# EasyEDA Pro project ESP32-S3-UNO_Easyeda_pro.epro

# Schematic Schematic1
Board Name: Board1; Create Date: 2025-07-17; Page Name: P1; Project Name: ESP32-S3-UNO; Schematic Name: Schematic1; Update Date: 2025-07-17; Company: EasyEDA.com; Page Size: A4; Version: V1.0
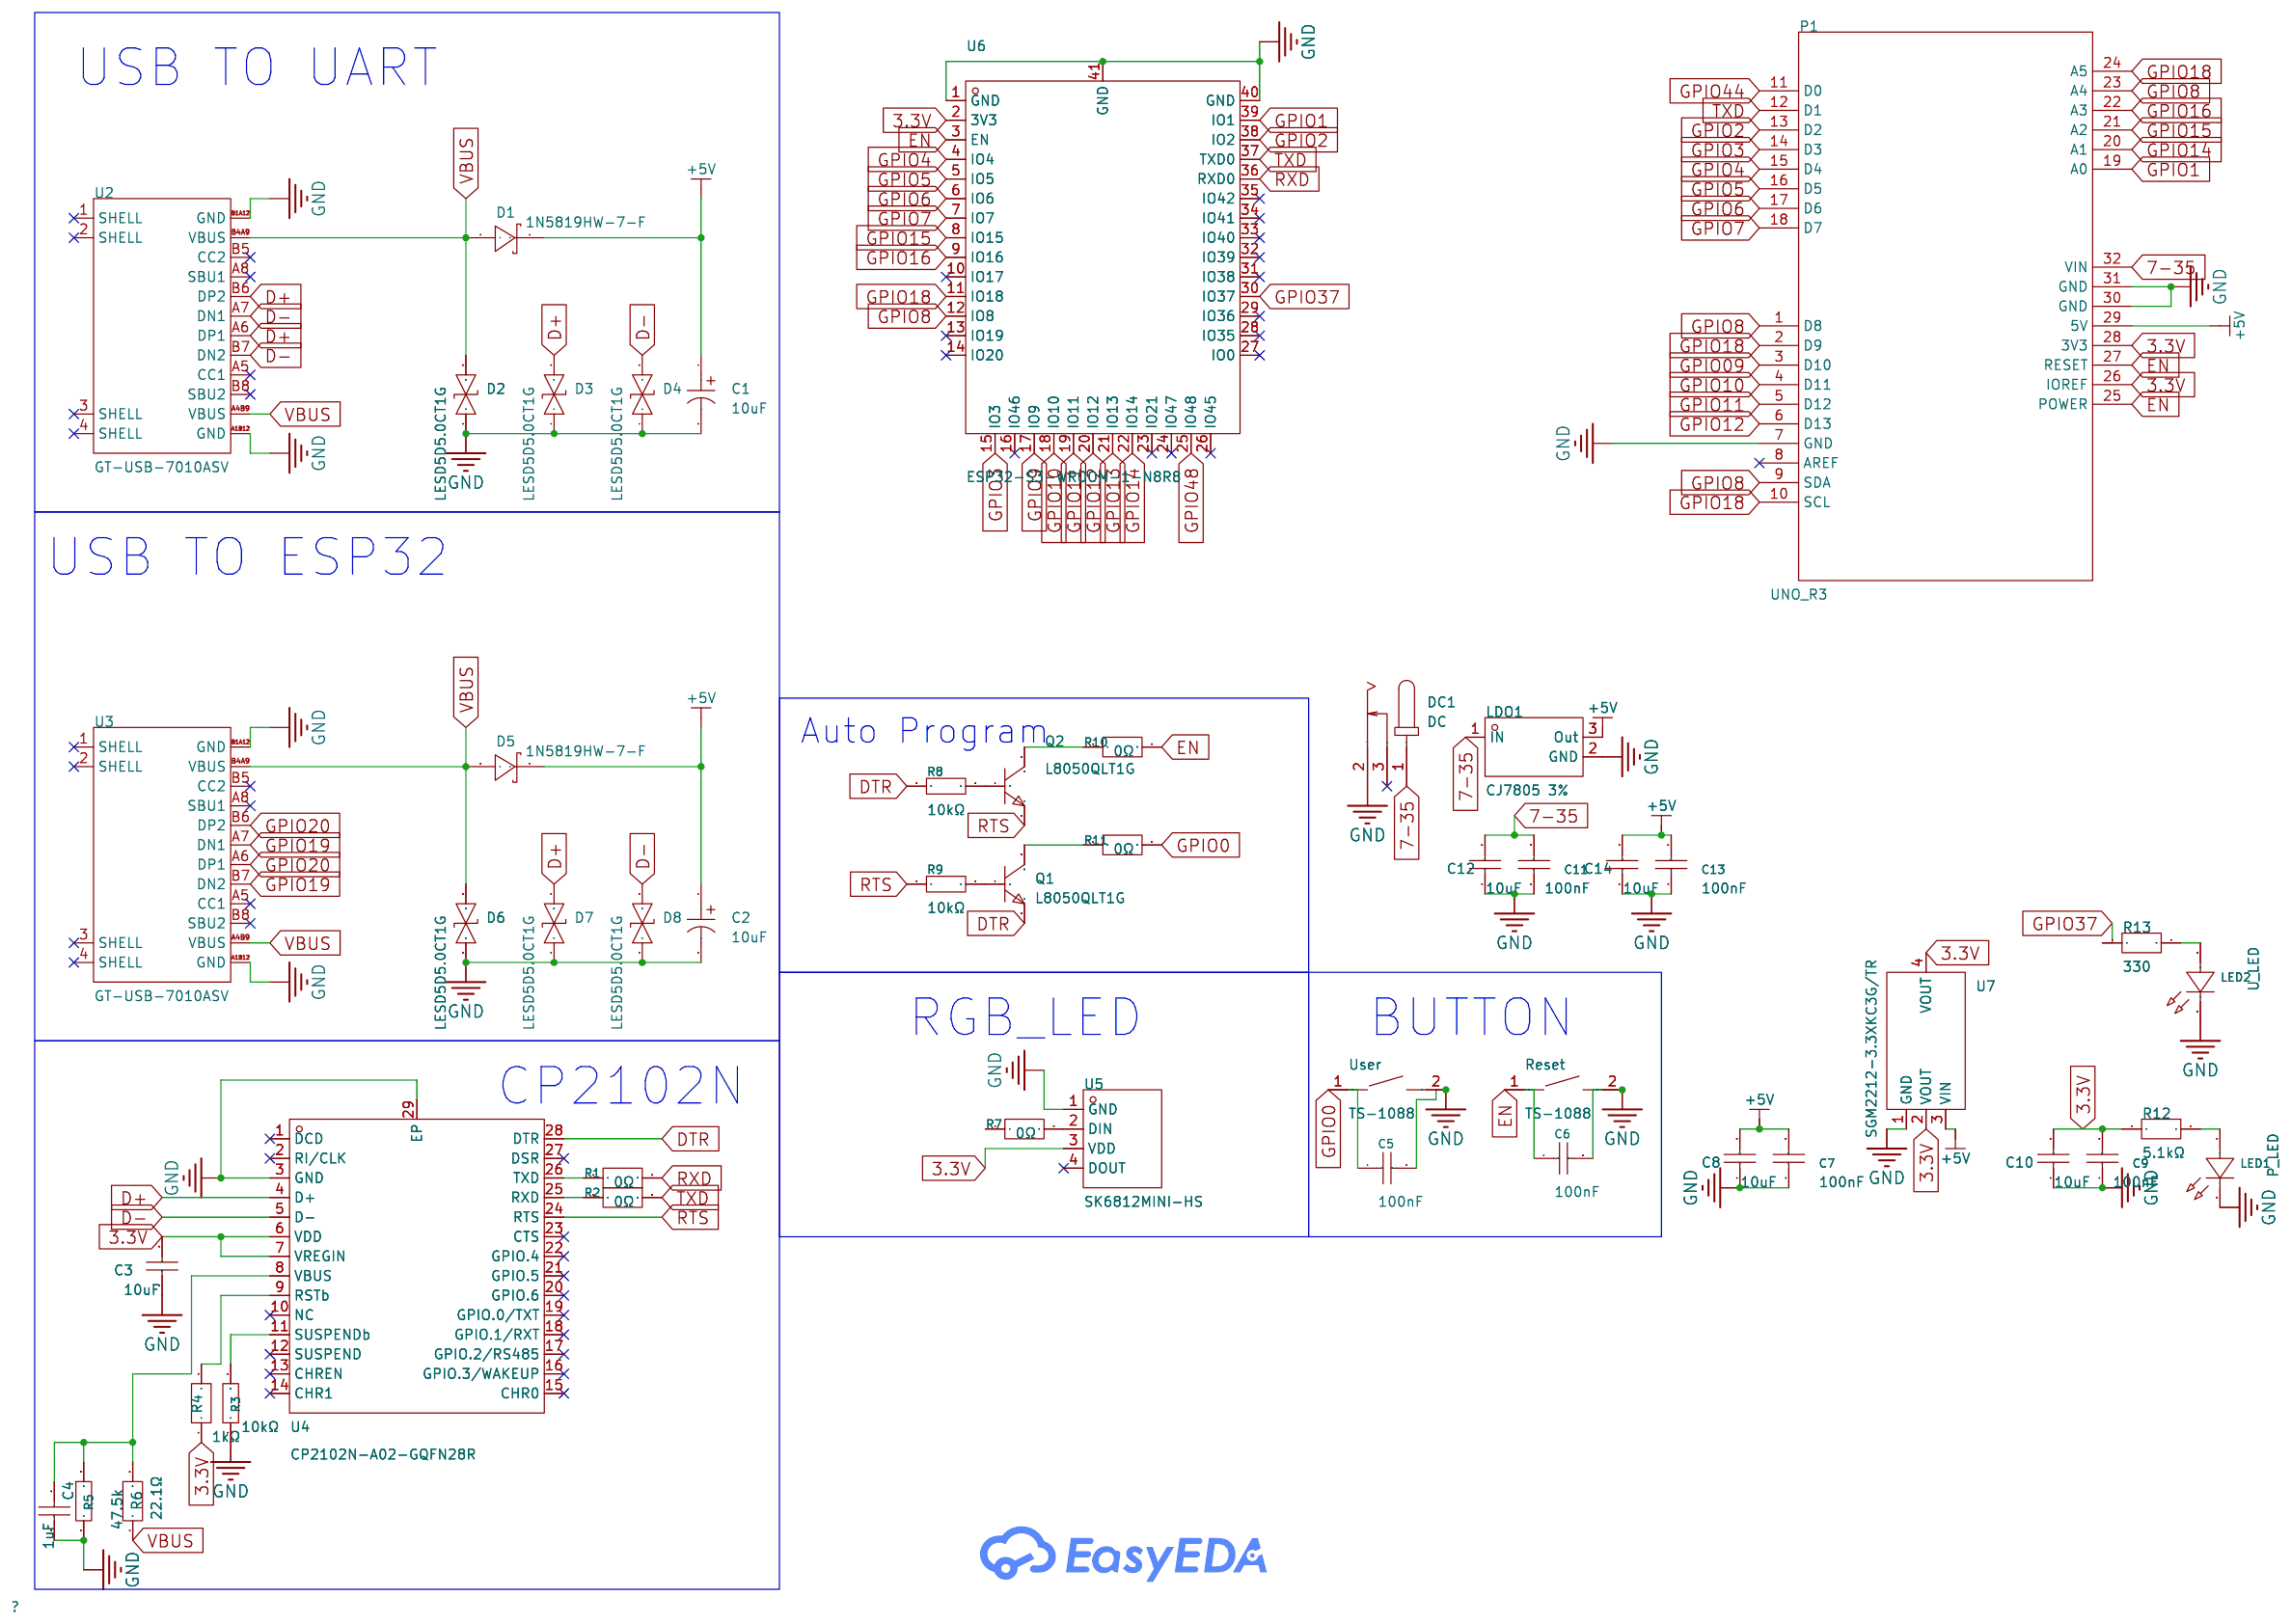
[diagram p0: schematic sheet]

## Parts
C1  10uF  [CAP-SMD_BD4.0-L4.3-W4.3-FD-LS5.3]
C2  10uF  [CAP-SMD_BD4.0-L4.3-W4.3-FD-LS5.3]
C3  10uF  [C1206]
C4  1uF  [C1206]
C5  100nF  [C1206]
C6  100nF  [C1206]
C7  100nF  [C1206]
C8  10uF  [C1206]
C9  100nF  [C1206]
C10  10uF  [C1206]
C11  100nF  [C1206]
C12  10uF  [C1206]
C13  100nF  [C1206]
C14  10uF  [C1206]
D1  1N5819HW-7-F  [SOD-123_L2.7-W1.6-LS3.7-RD]
D2  LESD5D5.0CT1G  [SOD-523_L1.2-W0.8-LS1.6-BI]
D3  LESD5D5.0CT1G  [SOD-523_L1.2-W0.8-LS1.6-BI]
D4  LESD5D5.0CT1G  [SOD-523_L1.2-W0.8-LS1.6-BI]
D5  1N5819HW-7-F  [SOD-123_L2.7-W1.6-LS3.7-RD]
D6  LESD5D5.0CT1G  [SOD-523_L1.2-W0.8-LS1.6-BI]
D7  LESD5D5.0CT1G  [SOD-523_L1.2-W0.8-LS1.6-BI]
D8  LESD5D5.0CT1G  [SOD-523_L1.2-W0.8-LS1.6-BI]
DC1  DC  [DC-IN-TH_DC005]
LDO1  CJ7805 3%  [TO-252-2_L6.6-W6.1-P4.58-LS10.1-BR-CW]
LED1  P_LED  [LED1206-R-RD_RED]
LED2  U_LED  [LED1206-R-RD_RED]
P1  UNO_R3  [UNO_R3]
Q1  L8050QLT1G  [SOT-23-3_L2.9-W1.3-P1.90-LS2.4-BR]
Q2  L8050QLT1G  [SOT-23-3_L2.9-W1.3-P1.90-LS2.4-BR]
R1  0Ω  [R1206]
R2  0Ω  [R1206]
R3  10kΩ  [R1206]
R4  1kΩ  [R1206]
R5  47.5k  [R1206]
R6  22.1Ω  [R1206]
R7  0Ω  [R1206]
R8  10kΩ  [R1206]
R9  10kΩ  [R1206]
R10  0Ω  [R1206]
R11  0Ω  [R1206]
R12  5.1kΩ  [R1206]
R13  330  [R1206]
Reset  TS-1088  [SW-SMD_L3.9-W3.0-P4.45]
U2  GT-USB-7010ASV  [USB-C-SMD_G-SWITCH_GT-USB-7010ASV]
U3  GT-USB-7010ASV  [USB-C-SMD_G-SWITCH_GT-USB-7010ASV]
U4  CP2102N-A02-GQFN28R  [QFN-28_L5.0-W5.0-P0.50-TL-EP3.3]
U5  SK6812MINI-HS  [LED-SMD_4P-L3.5-W3.5-BR_SK6812MINI-HS]
U6  ESP32-S3-WROOM-1-N8R8  [WIRELM-SMD_ESP32-S3-WROOM-1]
U7  SGM2212-3.3XKC3G/TR  [SOT-223-3_L6.5-W3.4-P2.30-LS7.0-BR]
User  TS-1088  [SW-SMD_L3.9-W3.0-P4.45]

## Library data of the parts
C1 C2 = EFVH025ADA100M0454: Capacitance:10uF Tolerance:±20% Tolerance:±20% Voltage Rating:25V Diameter:4mm Height - Seated (Max):5.4mm; LCSC Part Name: 10uF ±20% 25V; Supplier Part: C22387953; Manufacturer: FOLLON(富隆电子); Supplier Footprint: SMD,D4xL5.4mm; JLCPCB Part Class: Extended Part; Datasheet: https://atta.szlcsc.com/upload/public/pdf/source/20240424/E2403F09F3634268C234320018E14A29.pdf; Supplier: LCSC; Tolerance: ±20%; Voltage Rating: 25V; Diameter: 4mm; Height - Seated (Max): 5.4mm
C3 C8 C10 C12 C14 = CL31A106KBHNNNE: Capacitance: Tolerance:±10% Tolerance:±10% Voltage Rated: Temperature Coefficient:; LCSC Part Name: 10uF ±10% 50V; Supplier Part: C13585; Manufacturer: SAMSUNG(三星); Supplier Footprint: 1206; JLCPCB Part Class: Basic Part; Datasheet: https://atta.szlcsc.com/upload/public/pdf/source/20160218/1457707763339.pdf; Supplier: LCSC; Tolerance: ±10%
C4 = CL31B105KAHNNNE: Capacitance: Tolerance:±10% Tolerance:±10% Voltage Rated: Temperature Coefficient:; LCSC Part Name: 1uF ±10% 25V; Supplier Part: C28322; Manufacturer: SAMSUNG(三星); Supplier Footprint: 1206; JLCPCB Part Class: Extended Part; Datasheet: https://atta.szlcsc.com/upload/public/pdf/source/20160218/1457707763339.pdf; Supplier: LCSC; Tolerance: ±10%
C5-C7 C9 C11 C13 = CL31B104KBCNNNC: Capacitance: Tolerance:±10% Tolerance:±10% Voltage Rated: Temperature Coefficient:; LCSC Part Name: 100nF ±10% 50V; Supplier Part: C24497; Manufacturer: SAMSUNG(三星); Supplier Footprint: 1206; Datasheet: https://atta.szlcsc.com/upload/public/pdf/source/20160218/1457707763339.pdf; Supplier: LCSC; Tolerance: ±10%
D1 D5 = 1N5819HW-7-F: Forward Voltage (Vf@If):450mV@1A Reverse Voltage (Vr):40V Rectified Current:1A Reverse Leakage Current (Ir):1mA@40V; LCSC Part Name: 电压:40V 电流:1A; Supplier Part: C82544; Manufacturer: DIODES(美台); Supplier Footprint: SOD-123; JLCPCB Part Class: Extended Part; Datasheet: https://atta.szlcsc.com/upload/public/pdf/source/20161024/1477288459223.pdf; Supplier: LCSC; Forward Voltage (Vf@If): 450mV@1A; Reverse Voltage (Vr): 40V; Rectified Current: 1A; Reverse Leakage Current (Ir): 1mA@40V
D2-D4 D6-D8 = LESD5D5.0CT1G: polarity:Bidirectional Reverse Stand-Off Voltage (Vrwm):5V Maximum Clamping Voltage:18.6V Peak Pulse Current (Ipp):9.4A Breakdown Voltage:5.6V Type:ESD; LCSC Part Name: 双向ESD; Supplier Part: C383211; Manufacturer: LRC(乐山无线电); Supplier Footprint: SOD-523; JLCPCB Part Class: Extended Part; Datasheet: https://atta.szlcsc.com/upload/public/pdf/source/20190807/C383211_633DF4B4E2C161403226E5235FE33A1C.pdf; Supplier: LCSC; polarity: Bidirectional; Reverse Stand-Off Voltage (Vrwm): 5V; Maximum Clamping Voltage: 18.6V; Peak Pulse Current (Ipp): 9.4A; Breakdown Voltage: 5.6V; Type: ESD
DC1 = Z-DC00R02P-2000: Inside Contact Diameter:2mm Outside Contact Diameter:6.3mm Current Rating (Max):500mA Voltage Rating (Max):30V; LCSC Part Name: 内径:2mm 外径:6.3mm; Supplier Part: C132516; Manufacturer: Ckmtw(灿科盟); Supplier Footprint: 插件; Datasheet: https://atta.szlcsc.com/upload/public/pdf/source/20180105/C132516_15151572879811234526.pdf; Supplier: LCSC; Inside Contact Diameter: 2mm; Outside Contact Diameter: 6.3mm; Current Rating (Max): 500mA; Voltage Rating (Max): 30V
LDO1 = CJ7805 3%: Output Type:Fixed Voltage - Supply:35V Output Voltage:5V Output Voltage:5V Output Current:1.5A Voltage Dropout:2V@(1A) Output Configuration:Positive electrode Number of Outputs:1; LCSC Part Name: 输入35V 输出5V 1.5A; Supplier Part: C21706; Manufacturer: CJ(江苏长电/长晶); Supplier Footprint: TO-252-2(DPAK); Datasheet: https://atta.szlcsc.com/upload/public/pdf/source/20171228/C164904_15144413121361213907.pdf; Supplier: LCSC; Output Type: Fixed; Voltage - Supply: 35V; Output Voltage: 5V; Output Current: 1.5A; Voltage Dropout: 2V@(1A); Output Configuration: Positive electrode; Number of Outputs: 1
LED1 LED2 = XL-3216SURC: Emitted Color:Red Power Dissipation:55mW Forward Current:25mA Dominant Wavelength:617nm~621nm Dominant Wavelength:617nm~621nm Peak Wavelength:623nm Lens Color:无色透明透镜 Color Temperature:- Color Temperature:- Viewing Angle:120° Mounting Sytle:Positive post O; Supplier Part: C965822; Manufacturer: XINGLIGHT(成兴光); Supplier Footprint: 1206; JLCPCB Part Class: Extended Part; Datasheet: https://atta.szlcsc.com/upload/public/pdf/source/20221102/38B682A5E5FDBBFCA7077B6272CE8E6F.pdf; Supplier: LCSC; Emitted Color: Red; Power Dissipation: 55mW; Forward Current: 25mA; Dominant Wavelength: 617nm~621nm; Peak Wavelength: 623nm; Lens Color: 无色透明透镜; Viewing Angle: 120°; Mounting Sytle: Positive post; Operating Temperature: -30℃~+85℃
P1 = UNO_R3: _: 3
Q1 Q2 = L8050QLT1G: Transistor Type: Collector Current (Ic): Collector-Emitter Breakdown Voltage (Vceo): Power Dissipation (Pd): DC Current Gain (hFE@Ic,Vce):100@100mA,1V DC Current Gain (hFE@Ic,Vce):100@100mA,1V Collector Cut-Off Current (Icbo):150nA Collector-Emitter Satur; LCSC Part Name: NPN 电流:800mA 耐压:25V; Supplier Part: C49581; Manufacturer: LRC(乐山无线电); Supplier Footprint: SOT-23; JLCPCB Part Class: Extended Part; Datasheet: https://atta.szlcsc.com/upload/public/pdf/source/20150518/1457707314424.pdf; Supplier: LCSC; DC Current Gain (hFE@Ic,Vce): 100@100mA,1V; Collector Cut-Off Current (Icbo): 150nA; Collector-Emitter Saturation Voltage (VCE(sat)@Ic,Ib): 500mV@800mA,80mA; Operating Temperature: -55℃~+150℃
R1 R2 R7 R10 R11 = FRC1206P000 TS: Type:Thick Film Resistors Resistance: Tolerance:±5% Tolerance:±5% Power(Watts): Overload Voltage (Max): Operating Temperature Range:-55℃~+155℃ Operating Temperature Range:-55℃~+155℃; LCSC Part Name: 0Ω ±5% 250mW 厚膜电阻; Supplier Part: C2907406; Manufacturer: FOJAN(富捷); Supplier Footprint: 1206; JLCPCB Part Class: Extended Part; Datasheet: https://atta.szlcsc.com/upload/public/pdf/source/20211221/925EC7D7225764EE0046F22065062C87.pdf; Supplier: LCSC; Type: Thick Film Resistors; Tolerance: ±5%; Operating Temperature Range: -55℃~+155℃
R3 R5 R8 R9 = 1206W4F1002T5E: Type:Thick Film Resistors Resistance:10kΩ Tolerance:±1% Tolerance:±1% Power(Watts): Overload Voltage (Max): Temperature Coefficient:±100ppm/℃ Temperature Coefficient:±100ppm/℃ Operating Temperature Range:-55℃~+155℃ Operating Temperature Range:-55℃~+155℃; LCSC Part Name: 10kΩ ±1% 250mW 厚膜电阻; Supplier Part: C17902; Manufacturer: UNI-ROYAL(厚声); Supplier Footprint: 1206; JLCPCB Part Class: Basic Part; Datasheet: https://atta.szlcsc.com/upload/public/pdf/source/20200306/C422600_1E6D84923E4A46A82E41ADD87F860B5C.pdf; Supplier: LCSC; Type: Thick Film Resistors; Tolerance: ±1%; Temperature Coefficient: ±100ppm/℃; Operating Temperature Range: -55℃~+155℃
R4 = FRC1206J102 TS: Type:Thick Film Resistors Resistance:1kΩ Tolerance:±5% Tolerance:±5% Power(Watts): Overload Voltage (Max): Temperature Coefficient:±100ppm/℃ Temperature Coefficient:±100ppm/℃ Operating Temperature Range:-55℃~+155℃ Operating Temperature Range:-55℃~+155℃; LCSC Part Name: 1kΩ ±5% 250mW 厚膜电阻; Supplier Part: C2907440; Manufacturer: FOJAN(富捷); Supplier Footprint: 1206; JLCPCB Part Class: Extended Part; Datasheet: https://atta.szlcsc.com/upload/public/pdf/source/20211221/925EC7D7225764EE0046F22065062C87.pdf; Supplier: LCSC; Type: Thick Film Resistors; Tolerance: ±5%; Temperature Coefficient: ±100ppm/℃; Operating Temperature Range: -55℃~+155℃
R6 = RC1206FR-0722R1L: Type:Thick Film Resistors Resistance: Tolerance:±1% Tolerance:±1% Power(Watts):250mW Overload Voltage (Max): Temperature Coefficient:±100ppm/℃ Temperature Coefficient:±100ppm/℃ Operating Temperature Range:-55℃~+155℃ Operating Temperature Range:-55℃~+155℃; LCSC Part Name: 厚膜电阻 22.1Ω ±1% 250mW; Supplier Part: C488738; Manufacturer: YAGEO(国巨); Supplier Footprint: 1206; JLCPCB Part Class: Extended Part; Datasheet: https://atta.szlcsc.com/upload/public/pdf/source/20200407/C488738_3E27E9A444099C08246407991CCE4DDD.pdf; Supplier: LCSC; Type: Thick Film Resistors; Tolerance: ±1%; Power(Watts): 250mW; Temperature Coefficient: ±100ppm/℃; Operating Temperature Range: -55℃~+155℃
R12 R13 = FRC1206J512 TS: Type:Thick Film Resistors Resistance:5.1kΩ Tolerance:±5% Tolerance:±5% Power(Watts):0.25W Voltage-Supply(Max):200V Temperature Coefficient:±100ppm/℃ Temperature Coefficient:±100ppm/℃ Operating Temperature:-55℃~+155℃ Operating Temperature:-55℃~+155℃; LCSC Part Name: 5.1kΩ ±5% 250mW 厚膜电阻; Supplier Part: C2907509; Manufacturer: FOJAN(富捷); Supplier Footprint: 1206; Datasheet: https://atta.szlcsc.com/upload/public/pdf/source/20211221/925EC7D7225764EE0046F22065062C87.pdf; Supplier: LCSC; Type: Thick Film Resistors; Tolerance: ±5%; Power(Watts): 0.25W; Voltage-Supply(Max): 200V; Temperature Coefficient: ±100ppm/℃; Operating Temperature: -55℃~+155℃
Reset User = TS-1088-AR02016: Circuit:SPST Actuator Style:Round Button Operating Force:160gf Mounting Style:Brick nogging Switch Length:4mm Switch Width:3mm Switch Height:2mm Strike Gundam:不带 Contact Current:50mA Voltage Rating (DC):12V Insulation Resistance:100MΩ Actuator/Cap Color:B; LCSC Part Name: 4*3*2mm 立贴 轻触开关; Supplier Part: C720477; Manufacturer: XUNPU(讯普); Supplier Footprint: SMD; JLCPCB Part Class: Basic Part; Datasheet: https://atta.szlcsc.com/upload/public/pdf/source/20200810/C720475_60D09DD6C54279ADDB2DC25100F1CC11.pdf; Supplier: LCSC; Circuit: SPST; Actuator Style: Round Button; Operating Force: 160gf; Mounting Style: Brick nogging; Switch Length: 4mm; Switch Width: 3mm; Switch Height: 2mm; Strike Gundam: 不带; Contact Current: 50mA; Voltage Rating (DC): 12V; Insulation Resistance: 100MΩ; Actuator/Cap Color: Black; Pin Style: SMDSplicing; Mechanical Life: 10万次; Operating Temperature: -30℃~+80℃
U2 U3 = GT-USB-7010ASV: Connector Type:Type-C Standard:USB 2.0 Gender:Female Mounting Style:Horizontal attachment Number of Contacts:16P Number of Ports:1 Current Rating - Power (Max):3A Rated Voltage (Max):24V Connect-Disconnect Life:10,000 times Center Height:1.68mm Length:7.3; LCSC Part Name: Type-C 母 卧贴; Supplier Part: C2988369; Manufacturer: G-Switch(品赞); Supplier Footprint: SMD; Datasheet: https://atta.szlcsc.com/upload/public/pdf/source/20230327/DF227B64686AC8FA0AD1775797F2C3F1.pdf; Supplier: LCSC; Connector Type: Type-C; Standard: USB 2.0; Gender: Female; Mounting Style: Horizontal attachment; Number of Contacts: 16P; Number of Ports: 1; Current Rating - Power (Max): 3A; Rated Voltage (Max): 24V; Connect-Disconnect Life: 10,000 times; Center Height: 1.68mm; Length: 7.35mm; Core Colour: Black; Operating Temperature Range: -40℃~+85℃
U4 = CP2102N-A02-GQFN28R: Applications Function:USB to UART Protocol:- Voltage - Supply:3V~3.6V Voltage - Supply:3V~3.6V Operating Temperature:-40℃~+85℃@(Ta) Operating Temperature:-40℃~+85℃@(Ta); Supplier Part: C964632; Manufacturer: SKYWORKS/SILICON LABS(芯科); Supplier Footprint: QFN-28-EP(5x5); JLCPCB Part Class: Extended Part; Datasheet: https://atta.szlcsc.com/upload/public/pdf/source/20201204/C964632_F2B790CC23A72455AEF523510305B30A.pdf; Supplier: LCSC; Applications Function: USB to UART; Voltage - Supply: 3V~3.6V; Operating Temperature: -40℃~+85℃@(Ta)
U5 = SK6812MINI-HS: Supplier Part: C2922787; Manufacturer: 欧思科光电; Supplier Footprint: SMD,3.5x3.7mm; JLCPCB Part Class: Extended Part; Datasheet: https://atta.szlcsc.com/upload/public/pdf/source/20230410/362AD3320BBA53091A00A690D4E4D8BC.pdf; Supplier: LCSC
U6 = ESP32-S3-WROOM-1-N8R8: Supplier Part: C2913201; Manufacturer: ESPRESSIF(乐鑫); Supplier Footprint: SMD,25.5x18mm; JLCPCB Part Class: Extended Part; Datasheet: https://atta.szlcsc.com/upload/public/pdf/source/20241030/6A412B13087E1327DF6279F5735253CA.pdf; Supplier: LCSC
U7 = SGM2212-3.3XKC3G/TR_C3294699: Supplier Part: C3294699; Manufacturer: SGMICRO(圣邦微); Supplier Footprint: SOT-223-3; Supplier: LCSC

## Nets
3.3V: C3.2 C9.2 C10.2 P1.26(IOREF) P1.28(3V3) R4.1 R12.1 U4.6(VDD) U4.7(VREGIN) U5.3(VDD) U6.2(3V3) U7.2(VOUT) U7.4(VOUT)
+5V: C1.1 C2.1 C7.2 C8.2 C13.2 C14.2 D1.1(K) D5.1(K) LDO1.3(Out) P1.29(5V) U7.3(VIN)
GND: C1.2 C2.2 C3.1 C4.1 C5.2 C6.2 C7.1 C8.1 C9.1 C10.1 C11.1 C12.1 C13.1 C14.1 D2.1 D3.1 D4.1 D6.1 D7.1 D8.1 DC1.2 LDO1.2(GND) LED1.2(A) LED2.2(A) P1.7(GND) P1.30(GND) P1.31(GND) R3.1 R5.1 Reset.2 U2.A1B12(GND) U2.B1A12(GND) U3.A1B12(GND) U3.B1A12(GND) U4.3(GND) U4.29(EP) U5.1(GND) U6.1(GND) U6.40(GND) U6.41(GND) U7.1(GND) User.2
VBUS: D1.2(A) D2.2 D5.2(A) D6.2 R6.1 U2.A4B9(VBUS) U2.B4A9(VBUS) U3.A4B9(VBUS) U3.B4A9(VBUS)
7-35: C11.2 C12.2 DC1.1 LDO1.1(IN) P1.32(VIN)
D+: D3.2 D7.2 U2.A6(DP1) U2.B6(DP2) U4.4(D+)
D-: D4.2 D8.2 U2.A7(DN1) U2.B7(DN2) U4.5(D-)
DTR: Q1.2(E) R8.2 U4.28(DTR)
EN: C6.1 P1.25(POWER) P1.27(RESET) R10.2 Reset.1 U6.3(EN)
GPIO0: C5.1 R11.2 User.1
GPIO1: P1.19(A0) U6.39(IO1)
GPIO2: P1.13(D2) U6.38(IO2)
GPIO3: P1.14(D3) U6.15(IO3)
GPIO4: P1.15(D4) U6.4(IO4)
GPIO5: P1.16(D5) U6.5(IO5)
GPIO6: P1.17(D6) U6.6(IO6)
GPIO7: P1.18(D7) U6.7(IO7)
GPIO8: P1.1(D8) P1.9(SDA) P1.23(A4) U6.12(IO8)
GPIO09: P1.3(D10)
GPIO9: U6.17(IO9)
GPIO10: P1.4(D11) U6.18(IO10)
GPIO11: P1.5(D12) U6.19(IO11)
GPIO12: P1.6(D13) U6.20(IO12)
GPIO13: U6.21(IO13)
GPIO14: P1.20(A1) U6.22(IO14)
GPIO15: P1.21(A2) U6.8(IO15)
GPIO16: P1.22(A3) U6.9(IO16)
GPIO18: P1.2(D9) P1.10(SCL) P1.24(A5) U6.11(IO18)
GPIO19: U3.A7(DN1) U3.B7(DN2)
GPIO20: U3.A6(DP1) U3.B6(DP2)
GPIO37: R13.1 U6.30(IO37)
GPIO44: P1.11(D0)
GPIO48: U6.25(IO48)
RTS: Q2.2(E) R9.2 U4.24(RTS)
RXD: R1.2 U6.36(RXD0)
TXD: P1.12(D1) R2.2 U6.37(TXD0)
$1N5399: R2.1 U4.25(RXD)
$1N5402: R1.1 U4.26(TXD)
$1N5659: R3.2 U4.11(SUSPENDb)
$1N5763: R4.2 U4.9(RSTb)
$1N5937: C4.2 R5.2 R6.2 U4.8(VBUS)
$1N6303: R7.2 U5.2(DIN)
$1N6527: Q2.1(B) R8.1
$1N6570: Q1.1(B) R9.1
$1N6617: Q2.3(C) R10.1
$1N6655: Q1.3(C) R11.1
$1N8179: LED1.1(K) R12.2
$1N9735: LED2.1(K) R13.2

Not connected (* = marked no-connect by the designer): DC1 3*; P1 8(AREF)*; R7 1; U2 1(SHELL)* 2(SHELL)* 3(SHELL)* 4(SHELL)* A5(CC1)* A8(SBU1)* B5(CC2)* B8(SBU2)*; U3 1(SHELL)* 2(SHELL)* 3(SHELL)* 4(SHELL)* A5(CC1)* A8(SBU1)* B5(CC2)* B8(SBU2)*; U4 1(DCD)* 2(RI/CLK)* 10(NC)* 12(SUSPEND)* 13(CHREN)* 14(CHR1)* 15(CHR0)* 16(GPIO.3/WAKEUP)* 17(GPIO.2/RS485)* 18(GPIO.1/RXT)* 19(GPIO.0/TXT)* 20(GPIO.6)* 21(GPIO.5)* 22(GPIO.4)* 23(CTS)* 27(DSR)*; U5 4(DOUT)*; U6 10(IO17)* 13(IO19)* 14(IO20)* 16(IO46)* 23(IO21)* 24(IO47)* 26(IO45)* 27(IO0)* 28(IO35)* 29(IO36)* 31(IO38)* 32(IO39)* 33(IO40)* 34(IO41)* 35(IO42)*

## Notes on the sheet
- USB TO UART
- USB TO ESP32
- Auto Program
- RGB_LED
- BUTTON
- CP2102N

# Board PCB1
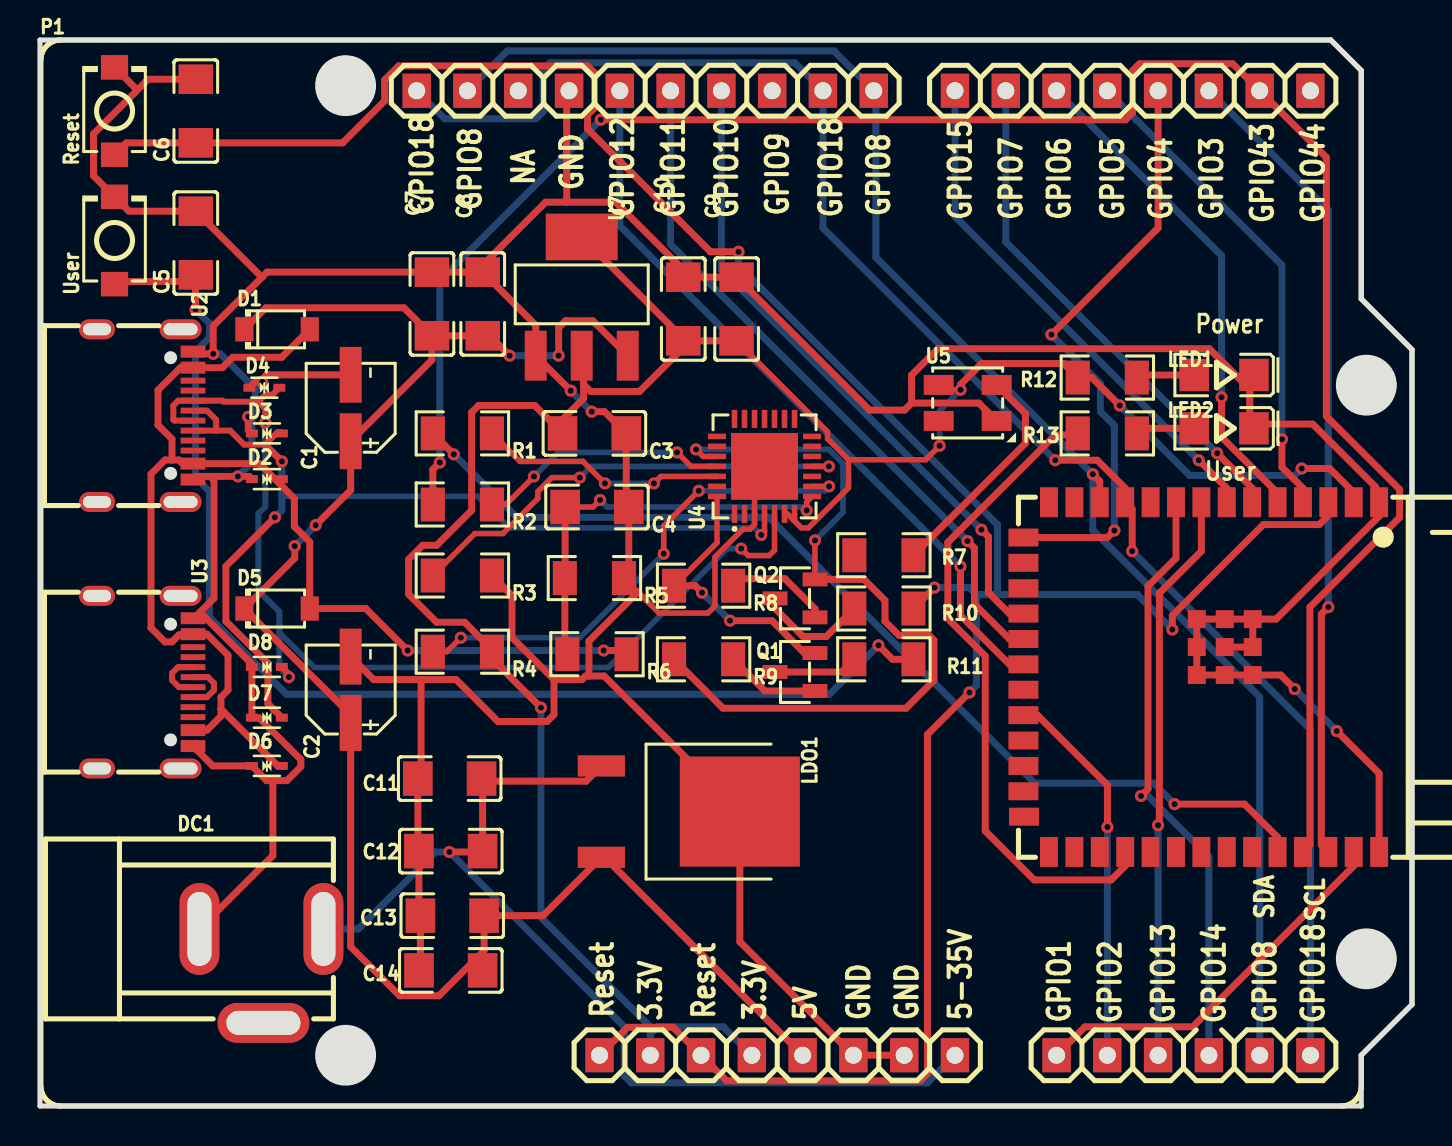
[diagram p1: board, top side]
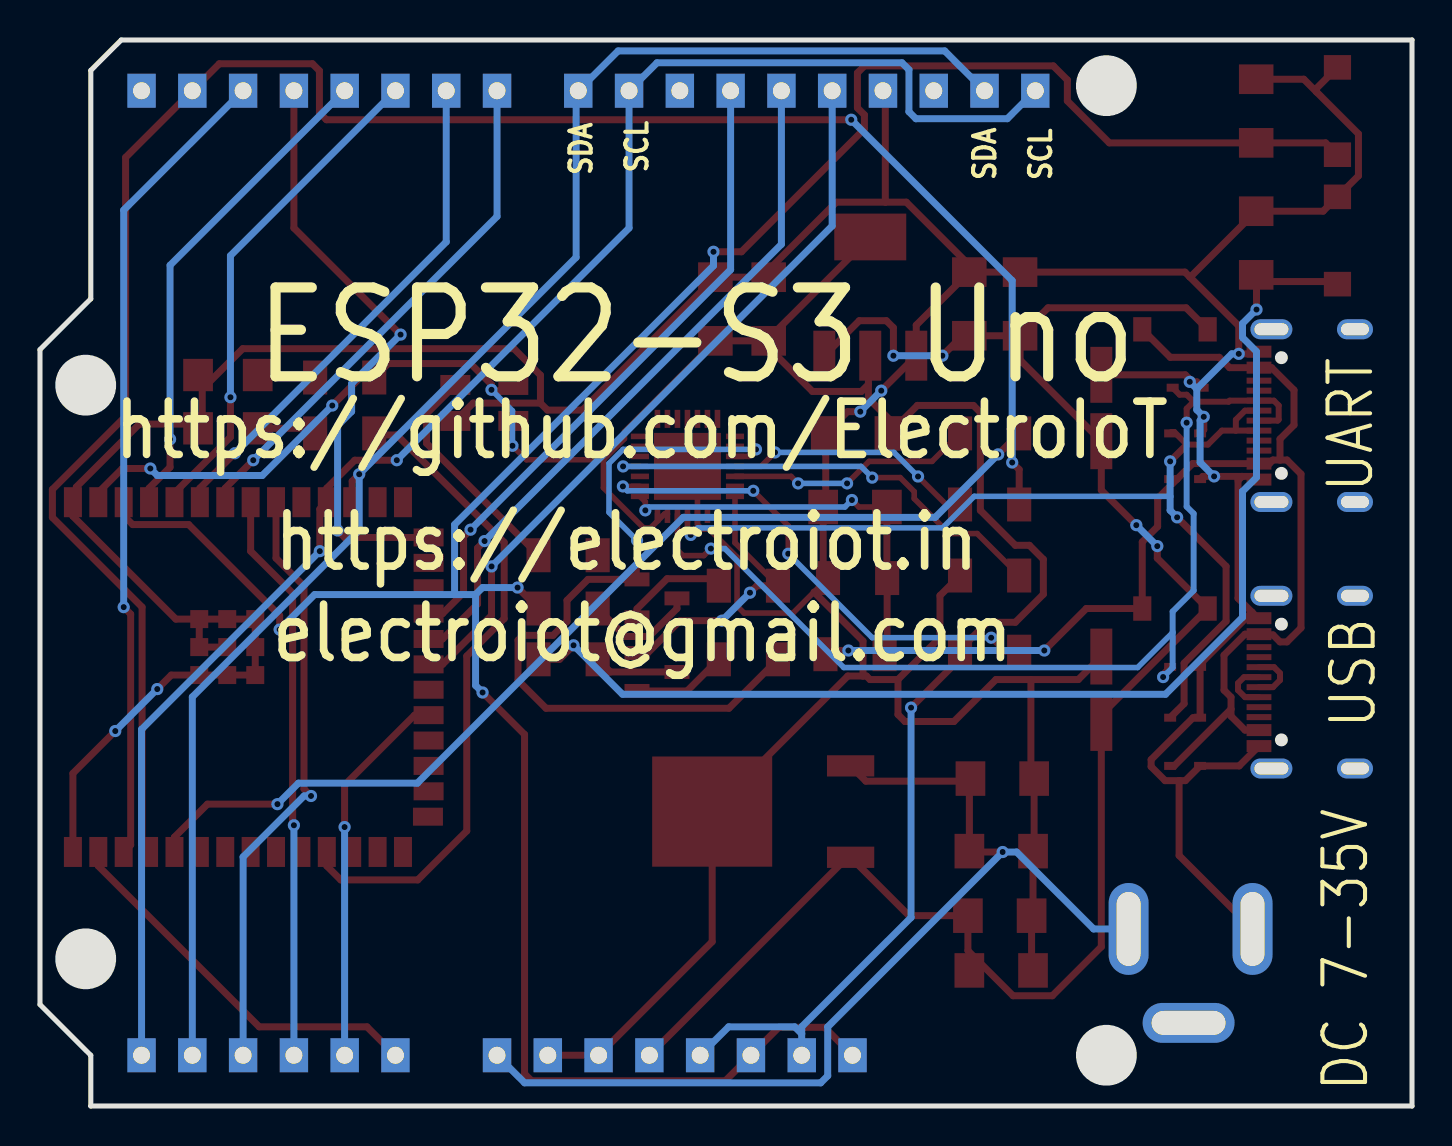
[diagram p2: board, bottom side, seen from below]

Outline 68.63 x 53.34 mm; copper layers: Top Layer, Bottom Layer. Coordinates in mm from the lower left corner of the outline.
Outline path: 0,53.34 0,0 66.09,0 66.09,2.54 68.63,5.08 68.63,37.85 66.09,40.39 66.09,51.82 64.56,53.34 0,53.34
Stack: Top Layer 0.035mm / Dielectric1 1.51mm FR4 er 4.5 / Bottom Layer 0.035mm

## Design rules (mm)
template: Custom Config
spacing copperThickness1oz (default): track to track 0.102, other pairs 0.152 to 0.3
spacing copperThickness2oz: track to track 0.203, other pairs 0.152 to 0.3
track width copperThickness1oz (default): min 0.127, default 0.35, max 2.54
track width copperThickness2oz: min 0.203, default 0.254, max 2.54
differential pair differentialPair (default): width min 0.127, default 0.254, max 2.54; gap min 0.152, default 0.152
via viaSize (default): diameter min 0.5, default 0.61, max 10; hole min 0.3, default 0.305, max 6.3

## Placement (name value [footprint] x y rotation side)
C1  10uF  [CAP-SMD_BD4.0-L4.3-W4.3-FD-LS5.3]  15.54 34.92 90 top
C2  10uF  [CAP-SMD_BD4.0-L4.3-W4.3-FD-LS5.3]  15.54 20.83 90 top
C3  10uF  [C1206]  27.73 33.66 180 top
C4  1uF  [C1206]  27.86 29.97 180 top
C5  100nF  [C1206]  7.79 43.18 90 top
C6  100nF  [C1206]  7.79 49.78 90 top
C7  100nF  [C1206]  19.6 40.13 270 top
C8  10uF  [C1206]  22.14 40.13 270 top
C9  100nF  [C1206]  34.84 39.88 270 top
C10  10uF  [C1206]  32.18 39.88 270 top
C11  100nF  [C1206]  20.49 16.38 0 top
C12  10uF  [C1206]  20.55 12.75 0 top
C13  100nF  [C1206]  20.62 9.53 0 top
C14  10uF  [C1206]  20.55 6.78 0 top
D1  1N5819HW-7-F  [SOD-123_L2.7-W1.6-LS3.7-RD]  11.86 38.86 0 top
D2  LESD5D5.0CT1G  [SOD-523_L1.2-W0.8-LS1.6-BI]  11.35 31.37 0 top
D3  LESD5D5.0CT1G  [SOD-523_L1.2-W0.8-LS1.6-BI]  11.35 33.66 0 top
D4  LESD5D5.0CT1G  [SOD-523_L1.2-W0.8-LS1.6-BI]  11.22 35.94 0 top
D5  1N5819HW-7-F  [SOD-123_L2.7-W1.6-LS3.7-RD]  11.86 24.89 0 top
D6  LESD5D5.0CT1G  [SOD-523_L1.2-W0.8-LS1.6-BI]  11.35 17.02 0 top
D7  LESD5D5.0CT1G  [SOD-523_L1.2-W0.8-LS1.6-BI]  11.35 19.43 0 top
D8  LESD5D5.0CT1G  [SOD-523_L1.2-W0.8-LS1.6-BI]  11.35 21.97 0 top
DC1  DC  [DC-IN-TH_DC005]  11.08 6.51 0 top
LDO1  CJ7805 3%  [TO-252-2_L6.6-W6.1-P4.58-LS10.1-BR-CW]  31.54 14.73 180 top
LED1  P_LED  [LED1206-R-RD_RED]  59.23 36.58 180 top
LED2  U_LED  [LED1206-R-RD_RED]  59.23 33.91 180 top
P1  -  [UNO_R3]  41.19 26.67 0 top
Q1  L8050QLT1G  [SOT-23-3_L2.9-W1.3-P1.90-LS2.4-BR]  37.77 21.72 0 top
Q2  L8050QLT1G  [SOT-23-3_L2.9-W1.3-P1.90-LS2.4-BR]  37.77 25.4 0 top
R1  0Ω  [R1206]  21.13 33.66 180 top
R2  0Ω  [R1206]  21.13 30.1 180 top
R3  10kΩ  [R1206]  21.13 26.54 180 top
R4  1kΩ  [R1206]  21.13 22.73 180 top
R5  47.5k  [R1206]  27.73 26.42 180 top
R6  22.1Ω  [R1206]  27.86 22.61 180 top
R7  0Ω  [R1206]  42.21 27.56 0 top
R8  10kΩ  [R1206]  33.19 26.03 180 top
R9  10kΩ  [R1206]  33.19 22.35 180 top
R10  0Ω  [R1206]  42.21 24.89 0 top
R11  0Ω  [R1206]  42.21 22.35 0 top
R12  5.1kΩ  [R1206]  53.39 36.45 0 top
R13  330  [R1206]  53.39 33.66 0 top
Reset  TS-1088  [SW-SMD_L3.9-W3.0-P4.45]  3.73 49.78 90 top
U2  GT-USB-7010ASV  [USB-C-SMD_G-SWITCH_GT-USB-7010ASV]  5.25 34.54 270 top
U3  GT-USB-7010ASV  [USB-C-SMD_G-SWITCH_GT-USB-7010ASV]  5.25 21.21 270 top
U4  CP2102N-A02-GQFN28R  [QFN-28_L5.0-W5.0-P0.50-TL-EP3.3]  36.24 32 90 top
U5  SK6812MINI-HS  [LED-SMD_4P-L3.5-W3.5-BR_SK6812MINI-HS]  46.4 35.18 0 top
U6  ESP32-S3-WROOM-1-N8R8  [WIRELM-SMD_ESP32-S3-WROOM-1]  58.08 21.46 270 top
U7  SGM2212-3.3XKC3G/TR  [SOT-223-3_L6.5-W3.4-P2.30-LS7.0-BR]  27.1 40.51 270 top
User  TS-1088  [SW-SMD_L3.9-W3.0-P4.45]  3.73 43.31 90 top

## Footprints (pads in the part's own frame, mm; a bottom-side part is the same pattern mirrored in y, then rotated)
C1206
  rect 1.485x1.728 smd: 1(-1.593,0) 2(1.593,0)
CAP-SMD_BD4.0-L4.3-W4.3-FD-LS5.3
  rect 2.8x1.1 smd: 1(-1.661,0) 2(1.661,0)
DC-IN-TH_DC005
  oval 2x4.6 hole 1.2x3.7: 1(3.1,2.35) 2(-3.1,2.35)
  oval 4.6x2 hole 3.7x1.2: 3(0.1,-2.35)
LED1206-R-RD_RED
  rect 1.485x1.62 smd: 1(1.492,0) 2(-1.492,0)
LED-SMD_4P-L3.5-W3.5-BR_SK6812MINI-HS
  rect 1.5x1 smd: 1(1.45,-0.9) 2(1.45,0.9) 3(-1.45,0.9) 4(-1.45,-0.9)
QFN-28_L5.0-W5.0-P0.50-TL-EP3.3
  rect 0.905x0.28 smd: 1(-2.377,1.5) 2(-2.377,1) 3(-2.377,0.5) 4(-2.377,0) 5(-2.377,-0.5) 6(-2.377,-1) 7(-2.377,-1.5) 15(2.377,-1.5) 16(2.377,-1) 17(2.377,-0.5) 18(2.377,0) 19(2.377,0.5) 20(2.377,1) 21(2.377,1.5)
  rect 0.28x0.905 smd: 8(-1.5,-2.377) 9(-1,-2.377) 10(-0.5,-2.377) 11(0,-2.377) 12(0.5,-2.377) 13(1,-2.377) 14(1.5,-2.377) 22(1.5,2.377) 23(1,2.377) 24(0.5,2.377) 25(0,2.377) 26(-0.5,2.377) 27(-1,2.377) 28(-1.5,2.377)
  rect 3.35x3.35 smd: 29(0,0)
R1206
  rect 1.208x1.701 smd: 1(-1.479,0) 2(1.479,0)
SOD-123_L2.7-W1.6-LS3.7-RD
  rect 0.91x1.22 smd: 1(-1.635,0) 2(1.635,0)
SOD-523_L1.2-W0.8-LS1.6-BI
  rect 0.6x0.4 smd: 1(-0.75,0) 2(0.75,0)
SOT-23-3_L2.9-W1.3-P1.90-LS2.4-BR
  rect 1.25x0.7 smd: 1(1,-0.95) 2(1,0.95) 3(-1,0)
SOT-223-3_L6.5-W3.4-P2.30-LS7.0-BR
  rect 2.5x1.1 smd: 1(2.97,-2.3) 2(2.97,0) 3(2.97,2.3)
  rect 2.34x3.6 smd: 4(-2.97,0)
SW-SMD_L3.9-W3.0-P4.45
  rect 1.23x1.36 smd: 1(-2.185,0) 2(2.185,0)
TO-252-2_L6.6-W6.1-P4.58-LS10.1-BR-CW
  rect 2.364x1.064 smd: 1(3.462,-2.286) 3(3.462,2.286)
  rect 6.004x5.512 smd: 2(-3.462,0)
UNO_R3
  rect 1.423x1.707 hole 0.849: 1(0.508,24.13) 2(-2.032,24.13) 3(-4.572,24.13) 4(-7.112,24.13) 5(-9.652,24.13) 6(-12.192,24.13) 7(-14.732,24.13) 8(-17.272,24.13) 9(-19.812,24.13) 10(-22.352,24.13) 11(22.352,24.13) 12(19.812,24.13) 13(17.272,24.13) 14(14.732,24.13) 15(12.192,24.13) 16(9.652,24.13) 17(7.112,24.13) 18(4.572,24.13) 19(9.652,-24.13) 20(12.192,-24.13) 21(14.732,-24.13) 22(17.272,-24.13) 23(19.812,-24.13) 24(22.352,-24.13) 25(-13.208,-24.13) 26(-10.668,-24.13) 27(-8.128,-24.13) 28(-5.588,-24.13) 29(-3.048,-24.13) 30(-0.508,-24.13) 31(2.032,-24.13) 32(4.572,-24.13)
USB-C-SMD_G-SWITCH_GT-USB-7010ASV
  oval 1x2.1 hole 0.6x1.7: 1(-4.32,1.78) 2(4.32,1.78)
  oval 1x1.8 hole 0.6x1.4: 3(4.32,-2.4) 4(-4.32,-2.4)
  rect 0.6x1.24 smd: A1B12(-3.2,2.4) A4B9(-2.4,2.4) B1A12(3.2,2.4) B4A9(2.4,2.4)
  rect 0.3x1.24 smd: A5(-1.25,2.4) A6(-0.25,2.4) A7(0.25,2.4) A8(1.25,2.4) B5(1.75,2.4) B6(0.75,2.4) B7(-0.75,2.4) B8(-1.75,2.4)
WIRELM-SMD_ESP32-S3-WROOM-1
  rect 1.5x0.9 smd: 1(-8.75,8.895) 2(-8.75,7.625) 3(-8.75,6.355) 4(-8.75,5.085) 5(-8.75,3.815) 6(-8.75,2.545) 7(-8.75,1.275) 8(-8.75,0.005) 9(-8.75,-1.265) 10(-8.75,-2.535) 11(-8.75,-3.805) 12(-8.75,-5.075) 13(-8.75,-6.345) 14(-8.75,-7.615) 27(8.75,-7.615) 28(8.75,-6.345) 29(8.75,-5.075) 30(8.75,-3.805) 31(8.75,-2.535) 32(8.75,-1.265) 33(8.75,0.005) 34(8.75,1.275) 35(8.75,2.545) 36(8.75,3.815) 37(8.75,5.085) 38(8.75,6.355) 39(8.75,7.625) 40(8.75,8.895)
  rect 0.9x1.5 smd: 15(-6.985,-8.895) 16(-5.715,-8.895) 17(-4.445,-8.895) 18(-3.175,-8.895) 19(-1.905,-8.895) 20(-0.635,-8.895) 21(0.635,-8.895) 22(1.905,-8.895) 23(3.175,-8.895) 24(4.445,-8.895) 25(5.715,-8.895) 26(6.985,-8.865)
  rect 0.9x0.9 smd: 41(-2.9,2.575) 41(-2.9,1.175) 41(-2.9,-0.225) 41(-1.5,2.575) 41(-1.5,1.175) 41(-1.5,-0.225) 41(-0.1,2.575) 41(-0.1,1.175) 41(-0.1,-0.225)

## Nets
As in the schematic.

Pads without a net: DC1 3; P1 8; R7 1; U2 1 2 3 4 A5 A8 B5 B8; U3 1 2 3 4 A5 A8 B5 B8; U4 1 2 10 12 13 14 15 16 17 18 19 20 21 22 23 27; U5 4; U6 10 13 14 16 23 24 26 27 28 29 31 32 33 34 35

## Via types
v1: diameter 0.61, hole 0.305, Top Layer to Bottom Layer, 68 vias

## Routing (per net, layer and track width the routed paths; a pad name or vN(x,y) marks a point on that pad's centre or on a via; arc(x,y) is an arc through that point)
3.3V: length 118.9
  Top Layer w0.28: C9.2 39.39,33.74 39.39,33.39 40.44,32.34 ; 40.44,32.34 40.44,30.94 38.43,28.93 38.08,28.93 37.73,29.28 ; 40.44,32.34 44.29,32.34 v1(44.99,33.04) ; U4.6 37.39,29.63 37.73,29.28 ; U5.3 45.19,35.84 v1(46.04,35.84) ; 37.73,29.28 U4.7
  Top Layer w0.35: 27.19,36.11 27.19,35.41 26.14,34.36 C3.2 24.74,35.06 21.94,35.06 21.59,34.7 21.59,29.81 19.84,28.06 19.14,28.06 18.44,27.36 18.44,25.61 19.84,24.2 21.24,24.2 22.61,22.84 22.61,22.38 v1(25.06,19.93) ; 27.19,36.11 27.19,37.45 U7.2 ; 27.19,36.11 27.54,35.75 29.99,35.75 32.18,37.94 C10.2 ; U6.2 65.71,30.7 64.51,31.9 v1(63.11,31.9) ; U7.4 32.18,38.4 C10.2 ; C10.2 C9.2 ; v1(46.04,35.84) 46.04,36.1 47.09,37.15 51.21,37.15 R12.1 52.61,36.45 v1(54.01,35.05)
  Bottom Layer w0.28: v1(46.04,35.84) 44.99,34.79 v1(44.99,33.04)
  Bottom Layer w0.35: 30.53,3.61 30.53,3.96 25.06,9.43 v1(25.06,19.93) ; 30.53,3.61 P1.26 ; 30.53,3.61 30.88,3.96 34.18,3.96 P1.28 ; v1(63.11,31.9) 62.76,31.55 57.51,31.55 v1(54.01,35.05)
+5V: length 91.8
  Top Layer w0.35: D1.1 11.3,39.94 18.2,39.94 C7.2 ; v1(13.79,29.06) 15.54,30.81 C1.1 19.6,37.33 C7.2 ; 21.7,7.27 22.21,7.78 C13.2 25.16,9.53 LDO1.3 28.24,12.45 P1.29 ; 21.7,7.27 21.7,7.22 C14.2 ; 21.7,7.27 19.95,5.52 17.99,5.52 15.54,7.97 C2.1 15.54,19.57 D5.1 12.74,27.41 v1(12.74,28.01) ; v1(23.49,37.54) 22.49,38.54 C8.2 C7.2 ; U7.3 27.65,39.29 26.29,39.29 25.94,38.94 v1(25.94,37.54)
  Bottom Layer w0.35: v1(13.79,29.06) v1(12.74,28.01) ; v1(23.49,37.54) v1(25.94,37.54)
GND: length 291.3
  Top Layer w0.28: R5.1 30.96,24.67 33.41,24.67 33.76,25.02 33.76,27.47 35.16,28.87 35.51,28.87 35.74,29.1 U4.3 35.74,31.5 U4.29
  Top Layer w0.35: 25.71,21.34 27.11,21.34 27.29,21.52 27.46,21.52 ; 25.71,21.34 23.61,23.44 23.61,25.54 22.61,26.54 ; 25.71,21.34 25.71,19.59 25.36,19.24 22.91,19.24 20.81,21.34 19.06,21.34 ; v1(64.86,18.76) 66.98,16.64 U6.40 ; 11.12,41.49 11.08,41.49 C5.2 4.45,44.77 User.2 2.68,46.54 2.68,48.64 4.78,50.74 ; 11.12,41.49 8.67,39.04 v1(8.67,37.64) 7.76,37.64 U2.A1B12 ; 11.12,41.49 11.36,41.72 C7.1 C8.1 ; 10.99,36.24 v1(11.12,36.24) ; 10.99,36.24 10.77,36.24 D4.1 ; 10.99,36.24 11.34,36.59 C1.2 ; P1.31 P1.30 35,8.22 LDO1.2 28.22,21.52 27.46,21.52 ; 43.59,35.17 43.59,36.57 44.92,37.89 58.48,37.89 60.16,36.22 ; 43.59,35.17 43.24,34.82 41.49,34.82 C9.1 C10.1 32.18,41.84 28.79,45.22 26.34,45.22 ; 43.59,35.17 46.96,35.17 U5.1 ; 8.5,31.5 8.7,31.3 8.7,25.41 8,24.71 ; 8.5,31.5 7.81,31.5 U2.B1A12 ; 8.5,31.5 v1(9.9,31.5) 10.46,31.5 D2.1 ; 29.91,25.72 27.46,23.27 27.46,21.52 ; R5.1 29.45,26.66 C4.1 29.32,30.1 C3.1 28.24,34.74 v1(27.6,34.74) ; C8.1 24.8,39.07 U7.1 v1(26.55,35.79) ; C8.1 22.14,42.07 25.29,45.22 26.34,45.22 ; 60.51,34.12 60.51,35.87 60.16,36.22 ; 60.51,34.12 LED2.2 ; 60.51,34.12 63.66,34.12 66.81,30.97 66.81,30.38 U6.1 66.98,29.51 61.83,24.36 U6.41 ; 8,24.71 7.7,24.41 U3.A1B12 ; 8,24.71 10.6,22.11 D8.1 D7.1 10.95,19.43 13.05,17.33 13.05,16.98 12.35,16.28 11.65,16.28 ; U6.41 U6.41 U6.41 U6.41 57.86,21.56 62.06,21.56 v1(62.76,20.86) ; U6.41 U6.41 U6.41 ; LED1.2 60.36,36.22 60.16,36.22 ; 11.65,16.28 11.34,16.28 D6.1 8.64,17.02 U3.B1A12 ; 11.65,16.28 11.65,12.53 DC1.2 ; C6.2 5.41,51.38 4.78,50.74 ; 26.34,45.22 26.34,50.68 P1.7 ; D3.1 10.42,33.84 v1(10.42,34.49) ; 4.78,50.74 4.78,50.92 3.73,51.97 ; C2.2 16.69,21.34 19.06,21.34 ; 19.06,21.34 19.06,16.54 C11.1 18.9,12.81 C12.1 18.95,9.6 C13.1 19.03,6.86 C14.1
  Bottom Layer w0.35: 10.77,35.89 10.77,34.84 v1(10.42,34.49) 10.6,34.3 10.6,32.2 v1(9.9,31.5) ; 10.77,35.89 v1(11.12,36.24) ; 10.77,35.89 9.02,37.64 v1(8.67,37.64) ; v1(62.76,20.86) v1(64.86,18.76) ; v1(26.55,35.79) v1(27.6,34.74)
VBUS: length 65.4
  Top Layer w0.35: 11.75,31.37 10.97,32.14 U2.B4A9 7.13,32.14 6.95,32.32 6.6,32.32 ; 11.75,31.37 D2.2 ; 11.75,31.37 12.72,30.39 12.72,28.99 13.49,28.23 D5.2 16.29,24.89 v1(18.39,22.79) ; R6.1 29.15,22.79 v1(28.19,22.79) ; D6.2 11.89,17.02 9.05,19.86 ; 6.6,32.32 6.6,33.37 5.9,34.07 5.9,35.82 7.02,36.94 U2.A4B9 9.12,36.94 9.64,37.46 12.09,37.46 D1.2 ; 6.6,32.32 6.25,32.32 5.55,31.62 5.55,23.92 6.25,23.22 6.6,23.22 6.95,23.57 7.62,23.57 7.65,23.61 8.35,23.61 9.4,22.56 9.4,20.81 9.05,20.46 9.05,19.86 ; 9.05,19.86 9.05,19.51 8.35,18.81 U3.B4A9
  Bottom Layer w0.35: v1(18.39,22.79) v1(28.19,22.79)
7-35: length 51.6
  Top Layer w0.35: 22.14,16.25 C11.2 ; 22.14,16.25 C12.2 22.1,12.71 v1(20.48,12.71) ; 22.14,16.25 27.32,16.25 LDO1.1
  Bottom Layer w0.35: P1.32 44.39,1.16 29.58,1.16 29.23,1.51 29.23,3.96 v1(20.48,12.71) 19.78,12.71 15.93,8.86 DC1.1
D+: length 49.1
  Top Layer w0.28: U4.4 36.24,28.74 v1(36.08,28.58)
  Top Layer w0.3: 8.81,33.79 8.81,34.34 8.35,34.79 U2.A6 ; 8.81,33.79 U2.B6 ; 8.81,33.79 9.51,33.79 10.21,33.09 11.26,33.09 11.89,33.72 12.03,33.72 D3.2
  Top Layer w0.35: v1(11.75,29.45) 9.3,27 9.3,24.26 11.4,22.16 11.4,20.13 D7.2 ; 11.26,33.09 v1(12.1,32.25)
  Bottom Layer w0.28: v1(36.08,28.58) 35.73,28.93 23.48,28.93 21.9,30.5 12.1,30.5
  Bottom Layer w0.35: v1(11.75,29.45) 12.1,29.81 v1(12.1,32.25)
D-: length 52.8
  Top Layer w0.28: v1(35.07,27.89) 35.42,27.54 36.47,27.54 36.74,27.81 U4.5
  Top Layer w0.3: 10.92,35.24 11.27,34.89 v1(11.27,34.19) ; 10.92,35.24 11.27,35.59 11.62,35.59 D4.2 ; 10.92,35.24 9.17,35.24 9.12,35.29 U2.B7 6.91,35.29 6.67,35.05 6.67,34.34 6.72,34.29 U2.A7 ; v1(12.45,21.46) 12.45,21.62 D8.2
  Bottom Layer w0.28: 11.97,23.69 13.72,21.94 28.42,21.94 34.37,27.89 v1(35.07,27.89)
  Bottom Layer w0.3: v1(11.27,34.19) 11.27,29.99 10.92,29.64 10.92,25.79 11.97,24.74 11.97,21.94 v1(12.45,21.46)
DTR: length 13.8
  Top Layer w0.28: U4.28 33.86,28.18 R8.2
  Top Layer w0.35: v1(34.51,24.28) 36.61,24.28 38.23,22.67 Q1.2 ; R8.2 32.76,26.03 v1(33.11,25.69)
  Bottom Layer w0.35: v1(33.11,25.69) v1(34.51,24.28)
EN: length 130.9
  Top Layer w0.35: v1(56.64,23.84) 56.64,24.54 61.19,29.09 63.99,29.09 64.34,29.44 64.34,30.11 U6.3 ; v1(46.49,20.69) 44.39,18.59 44.39,1.61 44.04,1.26 34.34,1.26 P1.27 31.67,3.94 29.39,3.94 P1.25 ; R10.2 v1(44.74,25.94) ; Reset.1 4.32,48.19 C6.1 15.14,48.19 17.24,50.29 17.24,51.34 17.94,52.04 27.39,52.04 27.74,51.69 27.74,49.94 27.39,49.59 27.39,48.89 33.54,42.74 v1(34.94,42.74)
  Bottom Layer w0.35: 47.89,25.59 54.89,25.59 v1(56.64,23.84) ; 47.89,25.59 47.89,29.09 34.94,42.04 v1(34.94,42.74) ; 47.89,25.59 46.84,25.59 ; 46.84,25.59 46.84,21.04 v1(46.49,20.69) ; 46.84,25.59 46.49,25.94 v1(44.74,25.94)
GPIO0: length 60.2
  Top Layer w0.35: 7.78,41.25 C5.1 ; 7.78,41.25 v1(7.78,39.85) ; 7.78,41.25 3.86,41.25 User.1 ; v1(41.94,23.05) 42.64,22.35 R11.2
  Bottom Layer w0.35: v1(7.78,39.85) 8.48,39.15 8.48,38.45 7.78,37.75 7.78,31.45 8.48,30.75 8.48,24.45 12.33,20.6 39.49,20.6 v1(41.94,23.05)
GPIO1: length 19.5
  Top Layer w0.35: U6.39 65.71,12.01 57.66,3.96 52.27,3.96 P1.19
GPIO2: length 40.9
  Top Layer w0.35: U6.38 64.09,13.06 64.09,24.61 v1(64.44,24.96)
  Bottom Layer w0.35: P1.13 64.44,44.83 v1(64.44,24.96)
GPIO3: length 30.2
  Top Layer w0.35: v1(50.59,38.6) 55.93,43.93 P1.14 ; U6.15 53.39,28.45 v1(53.74,28.8)
  Bottom Layer w0.35: v1(53.74,28.8) 53.74,34.05 53.04,34.75 53.04,36.15 v1(50.59,38.6)
GPIO4: length 24.6
  Top Layer w0.35: v1(62.12,33.36) 62.12,31.96 63.17,30.91 U6.4
  Bottom Layer w0.35: v1(62.12,33.36) 62.12,42.07 P1.15
GPIO5: length 25.2
  Top Layer w0.35: v1(59.1,35.46) 59.1,33.47 61.9,30.67 U6.5
  Bottom Layer w0.35: P1.16 59.1,42.55 v1(59.1,35.46)
GPIO6: length 25.7
  Top Layer w0.35: U6.6 60.63,30.91 v1(58.88,32.66)
  Bottom Layer w0.35: v1(58.88,32.66) 48.31,43.24 P1.17
GPIO7: length 26.2
  Top Layer w0.35: v1(57.96,32.31) 59.36,30.91 U6.7
  Bottom Layer w0.35: v1(57.96,32.31) 45.77,44.51 P1.18
GPIO8: length 79.8
  Top Layer w0.35: v1(52.66,31.61) 53.01,31.26 U6.12
  Bottom Layer w0.35: P1.9 23.37,52.79 39.71,52.79 41.81,50.69 41.81,42.46 v1(52.66,31.61) 52.66,28.81 61.01,20.47 P1.23
GPIO10: length 32.8
  Top Layer w0.35: U6.18 48.49,24.64 47.44,25.69 47.44,28.49 v1(47.09,28.84)
  Bottom Layer w0.35: P1.4 34.08,41.85 v1(47.09,28.84)
GPIO11: length 35.2
  Top Layer w0.35: v1(46.39,28.27) 46.74,27.92 46.74,25.12 48.49,23.37 U6.19
  Bottom Layer w0.35: P1.5 31.54,43.12 v1(46.39,28.27)
GPIO12: length 37.5
  Top Layer w0.35: U6.20 48.49,22.1 46.04,24.55 v1(46.04,27)
  Bottom Layer w0.35: v1(46.04,27) 29,44.04 P1.6
GPIO14: length 19.2
  Top Layer w0.35: U6.22 49.89,19.56 53.39,16.06 v1(53.39,13.96)
  Bottom Layer w0.35: v1(53.39,13.96) 53.39,2.54
GPIO15: length 28.6
  Top Layer w0.35: U6.8 58.09,27.76 55.99,25.66 55.99,14.11 v1(55.93,14.05)
  Bottom Layer w0.35: v1(55.93,14.05) P1.21
GPIO16: length 30
  Top Layer w0.35: v1(55.07,15.51) 55.42,15.86 55.42,26.01 56.82,27.41 U6.9
  Bottom Layer w0.35: v1(55.07,15.51) 55.42,15.51 58.47,12.47 P1.22
GPIO18: length 83.5
  Top Layer w0.35: v1(50.78,32.31) 52.88,32.31 54.28,30.91 U6.11 54.63,29.86 v1(54.63,27.76)
  Bottom Layer w0.35: P1.10 20.24,49.4 24.81,49.4 25.16,49.75 25.16,51.85 25.51,52.2 37.76,52.2 P1.2 39.16,43.93 v1(50.78,32.31) ; P1.24 63.55,18.85 v1(54.63,27.76)
GPIO19: length 2.7
  Top Layer w0.3: U3.B7 6.9,21.96 6.6,21.66 6.6,21.31 6.95,20.96 U3.A7
GPIO20: length 2.7
  Top Layer w0.3: U3.A6 8.4,21.46 8.7,21.16 8.7,20.81 8.35,20.46 U3.B6
GPIO37: length 33
  Top Layer w0.35: R13.1 51.83,33.58 50.78,33.58 45.41,28.21 45.41,24.39 47.28,22.51 47.28,13.76 49.73,11.31 53.58,11.31 54.28,12.01 U6.30
RTS: length 39.6
  Top Layer w0.28: v1(38.76,28.3) 38.76,26.35 ; v1(32.81,32.85) 33.16,32.5 U4.24
  Top Layer w0.35: Q2.2 41.21,26.35 42.27,25.3 42.27,24.25 42.96,23.55 44.47,23.55 44.71,23.31 44.71,21.3 43.31,19.9 34.16,19.9 R9.2
  Bottom Layer w0.28: v1(32.81,32.85) 39.46,32.85 40.16,32.15 40.16,29.7 v1(38.76,28.3)
RXD: length 51.4
  Top Layer w0.35: R1.2 v1(20.7,32.61) ; v1(56.75,15.11) 60.25,15.11 61.9,13.45 U6.36
  Bottom Layer w0.35: v1(20.7,32.61) 23.85,29.45 36.45,29.45 49.75,16.16 55.7,16.16 v1(56.75,15.11)
TXD: length 101.6
  Top Layer w0.35: R2.2 19.65,31.85 v1(20,32.2) ; U6.37 63.52,13.06 63.52,24.96 68.01,29.45 68.01,30.85 64.34,34.51 64.34,47.46 P1.12 59.66,52.15 55,52.15 54.65,51.8 54.65,49.7 54.3,49.35 v1(28.05,49.35)
  Bottom Layer w0.35: v1(20,32.2) 20,41.3 v1(28.05,49.35)
$1N5399: length 12.6
  Top Layer w0.28: v1(24.71,31.5) 23.31,30.1 22.61,30.1 ; v1(31.86,32.7) 32.56,32 U4.25
  Bottom Layer w0.28: v1(24.71,31.5) 25.91,32.7 v1(31.86,32.7)
$1N5402: length 12.4
  Top Layer w0.28: v1(28.26,31.15) 27.16,32.25 24.01,32.25 22.61,33.66 ; v1(30.71,31.15) 31.06,31.5 U4.26
  Bottom Layer w0.28: v1(28.26,31.15) v1(30.71,31.15)
$1N5659: length 23.1
  Top Layer w0.28: R3.2 21.75,28.64 23.15,28.64 24.9,30.39 24.9,30.74 25.6,31.44 v1(27,31.44) ; v1(39.46,32) U4.11
  Bottom Layer w0.28: v1(39.46,32) 27.56,32 v1(27,31.44)
$1N5763: length 24.9
  Top Layer w0.28: v1(32.95,30.78) 31.2,29.03 v1(31.2,27.63) ; R4.2 20.35,22.73 v1(21.05,23.43) ; v1(39.47,31) U4.9
  Bottom Layer w0.28: v1(39.47,31) 39.25,30.78 v1(32.95,30.78) ; v1(21.05,23.43) 27,23.43 v1(31.2,27.63)
$1N5937: length 20.7
  Top Layer w0.28: C4.2 27.67,29.97 v1(28.02,30.32) ; v1(38.35,29.8) 38.35,30.23 U4.8
  Top Layer w0.35: R6.2 26.25,22.73 26.25,26.42 26.27,26.43 C4.2
  Bottom Layer w0.28: v1(28.02,30.32) 28.37,29.97 38.18,29.97 v1(38.35,29.8)
$1N6303: length 11.4
  Top Layer w0.35: U5.2 49.29,34.64 49.29,33.16 R7.2
$1N6527: length 5.3
  Top Layer w0.35: Q2.1 38.77,24.88 37.26,26.39 35.02,26.39 R8.1
$1N6570: length 4.7
  Top Layer w0.35: Q1.1 36.26,20.77 R9.1
$1N6617: length 5.6
  Top Layer w0.35: Q2.3 36.77,24.89 38.17,23.49 39.33,23.49 R10.1
$1N6655: length 4.2
  Top Layer w0.35: R11.1 40.1,21.72 Q1.3
$1N8179: length 2.9
  Top Layer w0.35: LED1.1 54.99,36.58 R12.2
$1N9735: length 3
  Top Layer w0.35: LED2.1 55.12,33.91 R13.2

## Text on the board
Bottom Silkscreen Layer: SCL | SDA | USB | UART | DC 7-35V | https://electroiot.in | electroiot@gmail.com | https://github.com/ElectroIoT | ESP32-S3 Uno
Top Silkscreen Layer: Power | User | SDA | SCL | GPIO18 | GPIO8 | NA | GND | Reset | GPIO12 | 3.3V | GPIO11 | GPIO10 | GPIO9 | 5V | GPIO15 | 5-35V | GPIO7 | GPIO6 | GPIO1 | GPIO2 | GPIO5 | GPIO4 | GPIO13 | GPIO3 | GPIO14 | GPIO43 | GPIO44
